# Altium schematic sheet 04.Relays.SchDoc
size A4; DocumentNumber: 05; SheetNumber: 5; SheetTotal: 8; Page: Relay Channels
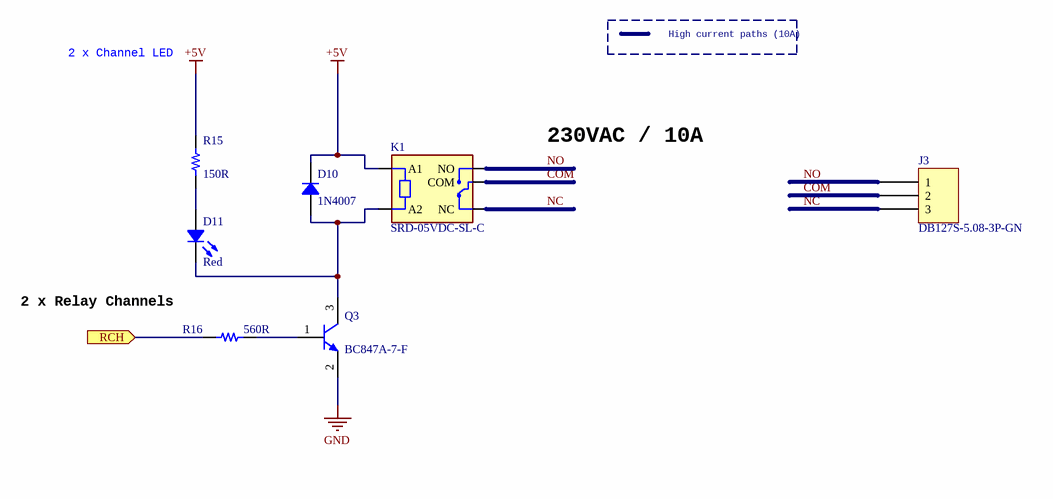
[diagram p0: 04.Relays.SchDoc]

## Parts
D10  1N4007  [DO214AC SMA]
D11  Red  [LED 0603_1608 RED]
J3  DB127S-5.08-3P-GN  [TE 282837-3]
K1  SRD-05VDC-SL-C  [RELAY_SRD-05VDC-SL-C]
Q3  BC847A-7-F  [DIODES SOT-23-3]
R15  150R  [RES 0603_1608]
R16  560R  [RES 0603_1608]

## Ports
RCH (in)

## Nets
+5V: D10.2 K1.A1 R15.2
GND: Q3.2(E)
COM: J3.2 K1.COM
NC: J3.3 K1.NC
NO: J3.1 K1.NO
RCH: R16.1 ; port RCH
NetD10_1: D10.1 D11.2 K1.A2 Q3.3(C)
NetD11_1: D11.1 R15.1
NetQ3_1: Q3.1(B) R16.2

## Notes on the sheet
- High current paths (10A)
- 2 x Channel LED
- 230VAC / 10A
- 2 x Relay Channels
- Title :
- Size:
- Date:
- Page :
- A4
- Number:
- Time:
- Revision:
- Sheet
- of
- Sheet Name :
- Drawn By :

## Library data of the parts
D10 = RS1A: 1A 1.1V@1A 1kV SMA(DO-214AC) Diodes - General Purpose ROHS; Manufacturer: YONGYUTAI; Manufacturer Part Number: 1N4007; JLC Part Number: C2892673
D11 = 5973005507F: -40℃~+85℃ Red 0603 Light Emitting Diodes (LED) ROHS; Manufacturer Part Number: KT-0603R; Manufacturer: Hubei KENTO Elec; JLC Part Number: C2286
J3 = 282837-3: P=5.08mm Screw terminal ROHS; Manufacturer: DIBO; Manufacturer Part Number: DB127S-5.08-3P-GN; JLC Part Number: C2997520
K1 = SRD-05VDC-SL-C: 5V Trigger Relay Module For Arduino And Raspberry Pi 5V Trigger Relay Module For Arduino And Raspberry Pi; MF: Songle Relay; Check_prices: https://www.snapeda.com/parts/SRD-05VDC-SL-C/Songle+Relay/view-part/?ref=eda; Value: *; Availability: Not in stock; Price: None; Package: NON STANDARD-5 Songle Relay; MP: SRD-05VDC-SL-C; SnapEDA_Link: https://www.snapeda.com/parts/SRD-05VDC-SL-C/Songle+Relay/view-part/?ref=snap
Q3 = BC847A-7-F: 65V 310mW 180@2mA,5V 100mA NPN SOT-23 Bipolar Transistors - BJT ROHS; Manufacturer: Diodes Incorporated; Manufacturer Part Number: BC847A-7-F; JLC Part Number: C2760576
R15 = RC0603FR-07150RL: 100mW Thick Film Resistors ±100ppm/℃ ±1% 150Ω 0603 Chip Resistor - Surface Mount ROHS; Manufacturer: Yageo; Manufacturer Part Number: RC0603FR-07150RL; Value: 150R; JLC Part Number: C114608
R16 = CRGP0603F560R: 100mW ±100ppm/℃ ±1% 560Ω 0603 Chip Resistor - Surface Mount ROHS; Manufacturer Part Number: RS-03K5600FT; Manufacturer: FH (Guangdong Fenghua Advanced Tech); Value: 560R; JLC Part Number: C136586